# Altium schematic sheet Amp.SchDoc
size A; SheetNumber: 1; SheetTotal: 2
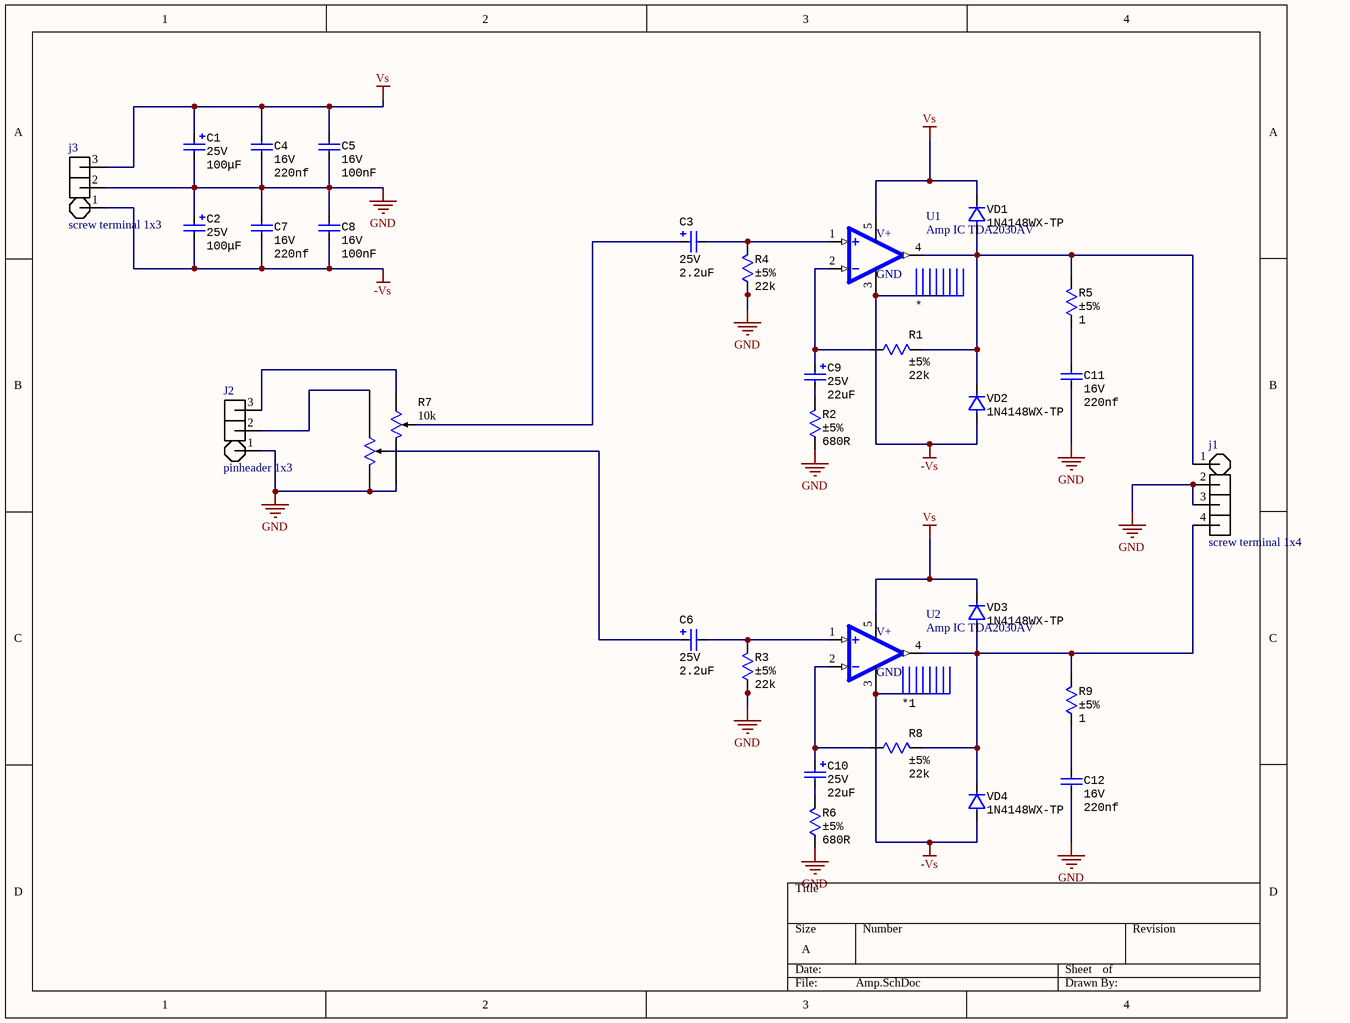
[diagram p0: Amp.SchDoc]

## Parts
*  Heatsink 1 pad transistor TO220  [Heatsink 1 pad SK95-2M3]  (value not drawn)
*1  Heatsink 1 pad transistor TO220  [Heatsink 1 pad SK95-2M3]  (value not drawn)
C1  value 100μF  Voltage: 25V  [CAP Electrolytic TH D8C3.5H12]
C2  value 100μF  Voltage: 25V  [CAP Electrolytic TH D8C3.5H12]
C3  value 2.2uF  Voltage: 25V  [CAP Electrolytic TH D6.3C2.5H11]
C4  value 220nf  Voltage: 16V  [Cap ceramic TH C050-025X075]
C5  value 100nF  Voltage: 16V  [Cap ceramic TH C025-024X044]
C6  value 2.2uF  Voltage: 25V  [CAP Electrolytic TH D6.3C2.5H11]
C7  value 220nf  Voltage: 16V  [Cap ceramic TH C050-025X075]
C8  value 100nF  Voltage: 16V  [Cap ceramic TH C025-024X044]
C9  value 22uF  Voltage: 25V  [CAP Electrolytic TH D5C2H11]
C10  value 22uF  Voltage: 25V  [CAP Electrolytic TH D5C2H11]
C11  value 220nf  Voltage: 16V  [Cap ceramic TH C050-025X075]
C12  value 220nf  Voltage: 16V  [Cap ceramic TH C050-025X075]
j1  screw terminal 1x4  [screw terminal 1x4]
J2  pinheader 1x3  [Pin Header 1x3 TH Pitch 2.54mm]
j3  screw terminal 1x3  [screw terminal 1x3]
R1  value 22k  Tolerance: ±5%  [RES TH 0.25W H 0207$10]
R2  value 680R  Tolerance: ±5%  [RES TH 0.25W H 0207$10]
R3  value 22k  Tolerance: ±5%  [RES TH 0.25W H 0207$10]
R4  value 22k  Tolerance: ±5%  [RES TH 0.25W H 0207$10]
R5  value 1  Tolerance: ±5%  [RES TH 0.25W H 0207$10]
R6  value 680R  Tolerance: ±5%  [RES TH 0.25W H 0207$10]
R7  value 10k  [Res VAR POT  TH 2 gang PDB182]
R8  value 22k  Tolerance: ±5%  [RES TH 0.25W H 0207$10]
R9  value 1  Tolerance: ±5%  [RES TH 0.25W H 0207$10]
U1  Amp IC TDA2030AV  [CB360]
U2  Amp IC TDA2030AV  [CB360]
VD1  PartNumber: 1N4148WX-TP  [Diode TH DO-41 (h) (1n4007)]
VD2  PartNumber: 1N4148WX-TP  [Diode TH DO-41 (h) (1n4007)]
VD3  PartNumber: 1N4148WX-TP  [Diode TH DO-41 (h) (1n4007)]
VD4  PartNumber: 1N4148WX-TP  [Diode TH DO-41 (h) (1n4007)]

## Nets
-Vs: *.1(S) *1.1(S) C2.2 C7.2 C8.2 j3.1 U1.3(GND) U2.3(GND) VD2.1 VD4.1
GND: C1.2 C2.1 C4.2 C5.2 C7.1 C8.1 C11.2 C12.2 j1.2 j1.3 J2.1 j3.2 R2.1 R3.1 R4.1 R6.1 R7.1 R7.6
Vs: C1.1 C4.1 C5.1 j3.3 U1.5(V+) U2.5(V+) VD1.2 VD3.2
NetC3_1: C3.1 R7.5
NetC3_2: C3.2 R4.2 U1.1(+IN)
NetC6_1: C6.1 R7.2
NetC6_2: C6.2 R3.2 U2.1(+IN)
NetC9_1: C9.1 R1.1 U1.2(-IN)
NetC9_2: C9.2 R2.2
NetC10_1: C10.1 R8.1 U2.2(-IN)
NetC10_2: C10.2 R6.2
NetC11_1: C11.1 R5.1
NetC12_1: C12.1 R9.1
Netj1_1: j1.1 R1.2 R5.2 U1.4(OUT) VD1.1 VD2.2
Netj1_4: j1.4 R8.2 R9.2 U2.4(OUT) VD3.1 VD4.2
NetJ2_2: J2.2 R7.3
NetJ2_3: J2.3 R7.4

## Library data of the parts
C1 C2 = Capacitor Aluminium: Manufacturer: Wurth; PartNumber: 860080475013; ValueManufacturerPartNumber: Aluminium capacitor, 100μF, 25V, ±20%, 54mOhm, 14x10x5 mm, -55...+105°C; TypeCapacitor: Aluminium capacitor; Tolerance: ±20%; Impedance: 54mOhm; Package: 14x10x5 mm; HelpURL: https://www.digikey.com/product-detail/en/wurth-electronics-inc/860080475013/732-9029-1-ND/5728972; Temperature: -55...+105°C
C3 C6 = Capacitor Aluminium: Manufacturer: Wurth; PartNumber: 860080475013; ValueManufacturerPartNumber: Aluminium capacitor, 2.2uF, 25V, ±20%, 54mOhm, 14x10x5 mm, -55...+105°C; TypeCapacitor: Aluminium capacitor; Tolerance: ±20%; Impedance: 54mOhm; Package: 14x10x5 mm; HelpURL: https://www.digikey.com/product-detail/en/wurth-electronics-inc/860080475013/732-9029-1-ND/5728972; Temperature: -55...+105°C
C4 C7 C11 C12 = Capacitor Ceramic: Manufacturer: Yageo; PartNumber: CC0201KRX7R7BB103; ValueManufacturerPartNumber: Ceramic capacitor, 220nf, X7R, ±10%, 16V, 0201, -55...+125°C; TypeCapacitor: Ceramic capacitor; Tolerance: ±10%; TypeDielectric: X7R; Package: 0201; HelpURL: https://www.digikey.com/product-detail/en/yageo/CC0201KRX7R7BB103/311-1404-1-ND/2833710; Temperature: -55...+125°C
C5 C8 = Capacitor Ceramic: Manufacturer: Yageo; PartNumber: CC0201KRX7R7BB103; ValueManufacturerPartNumber: Ceramic capacitor, 100nF, X7R, ±10%, 16V, 0201, -55...+125°C; TypeCapacitor: Ceramic capacitor; Tolerance: ±10%; TypeDielectric: X7R; Package: 0201; HelpURL: https://www.digikey.com/product-detail/en/yageo/CC0201KRX7R7BB103/311-1404-1-ND/2833710; Temperature: -55...+125°C
C9 C10 = Capacitor Aluminium: Manufacturer: Wurth; PartNumber: 860080475013; ValueManufacturerPartNumber: Aluminium capacitor, 22uF, 25V, ±20%, 54mOhm, 14x10x5 mm, -55...+105°C; TypeCapacitor: Aluminium capacitor; Tolerance: ±20%; Impedance: 54mOhm; Package: 14x10x5 mm; HelpURL: https://www.digikey.com/product-detail/en/wurth-electronics-inc/860080475013/732-9029-1-ND/5728972; Temperature: -55...+105°C
j1 = screw terminal 1x4: Conn Terminal Block 4 POS 5mm Solder ST Thru-Hole 10A Box; Manufacturer: Weidmuller; Manufacturer Part Number: 1821490000; Number of Poles: 4; Number of Levels: 1; Current: 20A; Voltage: 300V; Wire Gauge (Max): 24AWG; Wire Gauge (Min): 14AWG; Hole Diameter: 1.3mm; Stripping Length: 6mm; Approvals: CSA,cURus; Supplier 1: Digi-Key; RoHS: Yes; Category: Terminal Blocks; Stock 1: 135; Pricing 1: 1=3.28000, 10=2.48500, 25=2.30320, 50=2.07080, 100=2.02020, 250=1.76768, 500=1.61616, 1000=1.46464, 5000=1.34680 (USD); Mount: Through Hole; Color: Orange; Contact Material: Copper Alloy; Contact Plating: Tin; Housing Material: Thermoplastic; Housing Color: Orange; Min Operating Temperature: -50°C; Max Operating Temperature: 120°C; Number of Rows: 1; Package Quantity: 100; Packaging: Box; Number of Positions Per Level: 4; Termination: Screw; Voltage Rating: 300V; Current Rating: 10A; Number of Circuits: 4; Number of Contacts: 4; Series: Omnimate LM; Orientation: Straight; Pitch: 5mm; Radiation Hardening: No; Flammability Rating: UL94 V-0; RoHS Compliant: Yes; ComponentLink1URL: https://media.digikey.com/pdf/Data%20Sheets/Weidmuller%20PDFs/1821490000_DS.pdf?src-supplier=Digi-Key; ComponentLink1Description: https://media.digikey.com/pdf/Data%20Sheets/Weidmuller%20PDFs/1821490000_DS.pdf?src-supplier=Digi-Key; ComponentLink2URL: http://catalog.weidmueller.com/catalog/Start.do?localeId=en&ObjectID=1821490000&src-supplier=Avnet; ComponentLink2Description: http://catalog.weidmueller.com/catalog/Start.do?localeId=en&ObjectID=1821490000&src-supplier=Avnet; ComponentLink3URL: http://catalog.weidmueller.com/catalog/Start.do?localeId=en&ObjectID=1821490000&src-supplier=Avnet+Europe; ComponentLink3Description: http://catalog.weidmueller.com/catalog/Start.do?localeId=en&ObjectID=1821490000&src-supplier=Avnet+Europe; Supplier Part Number 1: 281-3310-ND
J2 = pinheader 1x3: SAMTEC - TSW-103-07-F-S - Pin Header, Unshrouded, Board-to-Board, 2.54 mm, 1 Rows, 3 Contacts, Through Hole, TSW Series; Number of Positions: 3; Connector Type: Male Pin; Gender: Male; Max Current Rating: 7.6A; Max Voltage Rating (AC): 550V; Pitch: 2.54mm; Supplier 1: Digi-Key; Manufacturer: Samtec; Manufacturer Part Number: TSW-103-07-F-S; RoHS: Yes; Category: Headers and Wire Housings; Stock 1: 23568; Pricing 1: 1=0.41000, 10=0.35000, 100=0.27220, 500=0.23332, 1000=0.19442, 5000=0.16665, 10000=0.15554 (USD); Mount: Through Hole; Contact Plating: Gold; Color: Black; Contact Material: Bronze; Housing Material: Polyester; Housing Color: Black; Min Operating Temperature: -55°C; Max Operating Temperature: 125°C; Number of Rows: 1; Packaging: Rail/Tube; Termination: Solder; Number of Contacts: 3; Package Quantity: 1; Orientation: Vertical; Series: TSW; Contact Type: Male Pin; Length: 7.62mm; Contact Mating Length: 0.23inch; Depth: 2.54mm; Radiation Hardening: No; REACH SVHC: No SVHC; RoHS Compliant: Yes; ComponentLink1URL: https://datasheet.ciiva.com/739/tsw-xxx-xx-xxx-x-xx-xxx-mkt-739892.pdf?src-supplier=Digi-Key; ComponentLink1Description: https://datasheet.ciiva.com/739/tsw-xxx-xx-xxx-x-xx-xxx-mkt-739892.pdf?src-supplier=Digi-Key; Supplier Part Number 1: SAM8995-ND
j3 = screw terminal 1x3: PCB Terminal Block 3 Poles, 5 mm Pitch, 691101710003, Würth Elektronik; Manufacturer: Wurth Electronics; Plating: Steel; Number of Levels: 1; Number of Positions Per Level: 3; Current: 16A; Voltage: 250V; Wire Gauge (Max): 26AWG; Wire Gauge (Min): 14AWG; Pitch: 0.197inch; Stripping Length: -7mm; Supplier 1: Digi-Key; Manufacturer Part Number: 691101710003; RoHS: Yes; Category: Terminal Blocks; Stock 1: 955; Pricing 1: 1=0.96000, 10=0.86200, 50=0.74500, 100=0.69120 (USD); Mount: Through Hole; Color: Blue; Housing Material: PA66; Contact Material: Brass; Contact Plating: Tin; Min Operating Temperature: -40°C; Max Operating Temperature: 105°C; Packaging: Bulk; Termination: Screw; Package Quantity: 400; Number of Contacts: 3; Series: WR-TBL Series 101; Voltage Rating: 250V; Current Rating: 16A; Length: 9mm; Width: 16.2mm; Height: 16.4mm; Wire/Cable Gauge: 26AWG; REACH SVHC: Unknown; RoHS Compliant: Yes; ComponentLink1URL: https://datasheet.ciiva.com/824/6911017100xx-824072.pdf?src-supplier=Digi-Key; ComponentLink1Description: https://datasheet.ciiva.com/824/6911017100xx-824072.pdf?src-supplier=Digi-Key; Supplier Part Number 1: 732-2027-ND
R1 R3 R4 R8 = Resistor Fixed: Manufacturer: Yageo; PartNumber: RC0201JR-07100RL; ValueManufacturerPartNumber: Resistor film, 22k, ±5%, 0201, 0.05W, -55...+125°C; TypeResistor: Resistor film; Power: 0.05W; Package: 0201; HelpURL: https://www.digikey.com/product-detail/en/yageo/RC0201JR-07100RL/311-100NCT-ND/1949006; Temperature: -55...+125°C
R2 R6 = Resistor Fixed: Manufacturer: Yageo; PartNumber: RC0201JR-07100RL; ValueManufacturerPartNumber: Resistor film, 680R, ±5%, 0201, 0.05W, -55...+125°C; TypeResistor: Resistor film; Power: 0.05W; Package: 0201; HelpURL: https://www.digikey.com/product-detail/en/yageo/RC0201JR-07100RL/311-100NCT-ND/1949006; Temperature: -55...+125°C
R5 R9 = Resistor Fixed: Manufacturer: Yageo; PartNumber: RC0201JR-07100RL; ValueManufacturerPartNumber: Resistor film, 1, ±5%, 0201, 0.05W, -55...+125°C; TypeResistor: Resistor film; Power: 0.05W; Package: 0201; HelpURL: https://www.digikey.com/product-detail/en/yageo/RC0201JR-07100RL/311-100NCT-ND/1949006; Temperature: -55...+125°C
R7 = Resistor Potentiometer 2 Gang: Manufacturer: Bourns; PartNumber: 3296W-1-103LF; TypeResistor: Resistor film; Power: 0.5W; Package: 3296W; HelpURL: https://www.digikey.com/product-detail/en/bourns-inc/3296W-1-103LF/3296W-103LF-ND/1088045; ValueManufacturerPartNumber: =TypeResistor+', '+Value+', '+Tolerance+', '+Package+', '+Power+', '+Temperature; Temperature: -55...+125°C
U1 U2 = Amp IC TDA2030AV: STMICROELECTRONICS         TDA2030AV.             Audio Power Amplifier, 18 W, 5 Pins; Min Dual Supply Voltage: 6V; Max Dual Supply Voltage: 22V; Voltage Gain: 80dB; Power Supply Rejection Ratio (PSRR): 54dB; Dual Supply Voltage: 18V; Max Power Dissipation: 20W; Max Output Current: 3.5A; Output Power: 18W; Number of Channels: 1; Bandwidth: 100kHz; Nominal Supply Current: 80mA; Input Offset Voltage (Vos): 20mV; Input Bias Current: 2uA; Supply Type: Dual; Load Impedance: 4R; Price: None; MP: TDA2030AV; Package: Pentawatt-5 STMicroelectronics; Value: *; Availability: Unavailable; MF: STMicroelectronics; SnapEDA_Link: https://www.snapeda.com/parts/TDA2030AV/STMicroelectronics/view-part/49020/?ref=snap; Supplier 1: Digi-Key; Manufacturer: STMicroelectronics; Manufacturer Part Number: TDA2030AV; RoHS: Yes; Category: Amplifiers - Audio; Mount: Through Hole; Number of Pins: 5; Min Operating Temperature: -40°C; Max Operating Temperature: 150°C; Packaging: Rail/Tube; Max Supply Voltage: 22V; Output Current: 3.5A; Package Quantity: 50; Gain: 80dB; Max Output Power: 18W; Power Dissipation: 20W; Gain Bandwidth Product: 100kHz; Quiescent Current: 80mA; Series: -; Supply Current: 80mA; Length: 10.4mm; Width: 4.8mm; Height: 9.2mm; Radiation Hardening: No; REACH SVHC: No SVHC; Lead Free: Lead Free; RoHS Compliant: Yes; ComponentLink1URL: https://datasheet.ciiva.com/15131/getdatasheetpartid-129946-15131656.pdf?src-supplier=Verical; ComponentLink1Description: https://datasheet.ciiva.com/15131/getdatasheetpartid-129946-15131656.pdf?src-supplier=Verical; ComponentLink2URL: https://datasheet.ciiva.com/14153/wltda2030a-data-en-14153246.pdf?src-supplier=Distrelec; ComponentLink2Description: https://datasheet.ciiva.com/14153/wltda2030a-data-en-14153246.pdf?src-supplier=Distrelec; ComponentLink3URL: https://datasheet.ciiva.com/4767/cd00000129-102656-4767379.pdf?src-supplier=Mouser; ComponentLink3Description: https://datasheet.ciiva.com/4767/cd00000129-102656-4767379.pdf?src-supplier=Mouser; ComponentLink4URL: https://datasheet.ciiva.com/19480/1416796-19480428.pdf?src-supplier=Jameco; ComponentLink4Description: https://datasheet.ciiva.com/19480/1416796-19480428.pdf?src-supplier=Jameco; ComponentLink5URL: https://datasheet.ciiva.com/26842/tda2030av-26842465.pdf?src-supplier=IIIC; ComponentLink5Description: https://datasheet.ciiva.com/26842/tda2030av-26842465.pdf?src-supplier=IIIC; ComponentLink6URL: https://datasheet.ciiva.com/1481/cd00000129-1481701.pdf?src-supplier=Element14; ComponentLink6Description: https://datasheet.ciiva.com/1481/cd00000129-1481701.pdf?src-supplier=Element14; ComponentLink7URL: https://datasheet.ciiva.com/1789/cd00000129-1789157.pdf?src-supplier=Digi-Key; ComponentLink7Description: https://datasheet.ciiva.com/1789/cd00000129-1789157.pdf?src-supplier=Digi-Key; ComponentLink8URL: https://datasheet.ciiva.com/18417/70014117-18417402.pdf?src-supplier=Allied+Electronics; ComponentLink8Description: https://datasheet.ciiva.com/18417/70014117-18417402.pdf?src-supplier=Allied+Electronics; ComponentLink9URL: https://datasheet.ciiva.com/2967/cd00000129-2967841.pdf?src-supplier=Avnet; ComponentLink9Description: https://datasheet.ciiva.com/2967/cd00000129-2967841.pdf?src-supplier=Avnet; Supplier Part Number 1: 497-2165-5-ND
VD1-VD4 = Diode single: Manufacturer: Micro Commercial; ValueManufacturerPartNumber: Single diode, 75V, 150mA, 1V, 4ns, SOD-323, -55...+150°C; TypeDiode: Single diode; Voltage: 75V; Current: 150mA; VoltageDrop: 1V; RecoveryTime: 4ns; Package: SOD-323; HelpURL: https://www.digikey.com/product-detail/en/micro-commercial-co/1N4148WX-TP/1N4148WXTPMSCT-ND/717312; Temperature: -55...+150°C